# EAGLE design Tractive System Active Light rev1 (EAGLE 9.5.2)
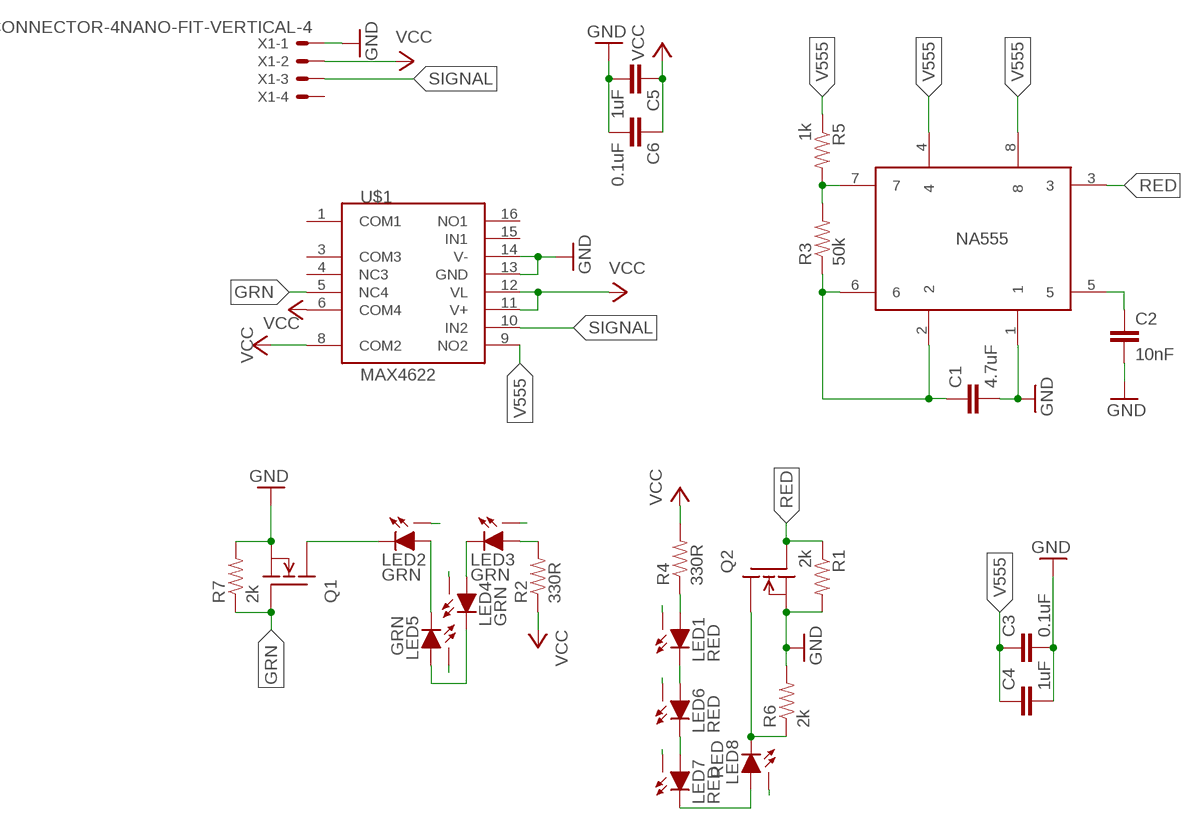
[diagram p0: schematic, sheet 1]

## Parts
C1  4.7uF  CAP0603-CAP  [0603-CAP]
C2  10nF  CAP0603-CAP  [0603-CAP]
C3  0.1uF  CAP0603-CAP  [0603-CAP]
C4  1uF  CAP0603-CAP  [0603-CAP]
C5  1uF  CAP0603-CAP  [0603-CAP]
C6  0.1uF  CAP0603-CAP  [0603-CAP]
LED1  RED  XP-E2XP-E2  [XP-E2]
LED2  GRN  XP-E2XP-E2  [XP-E2]
LED3  GRN  XP-E2XP-E2  [XP-E2]
LED4  GRN  XP-E2XP-E2  [XP-E2]
LED5  GRN  XP-E2XP-E2  [XP-E2]
LED6  RED  XP-E2XP-E2  [XP-E2]
LED7  RED  XP-E2XP-E2  [XP-E2]
LED8  RED  XP-E2XP-E2  [XP-E2]
NA555  NA555SO-8  [SOIC-08]
Q1  DMG3406LSOT  [SOT23]
Q2  DMG3406LSOT  [SOT23]
R1  2k  RESISTOR0603-RES  [0603-RES]
R2  330R  RESISTOR0603-RES  [0603-RES]
R3  50k  RESISTOR0603-RES  [0603-RES]
R4  330R  RESISTOR0603-RES  [0603-RES]
R5  1k  RESISTOR0603-RES  [0603-RES]
R6  2k  RESISTOR0603-RES  [0603-RES]
R7  2k  RESISTOR0603-RES  [0603-RES]
U$1  MAX4622  [SO16]
X1  CONNECTOR-4NANO-FIT-VERTICAL-4  [NANO-FIT_VERTICAL-4]

## Nets
GND: C1.2 C2.2 C3.2 C4.2 C5.2 C6.2 NA555.1 Q1.2(S) Q2.2(S) R1.2 R6.2 R7.2 U$1.13(GND) U$1.14(V-) X1.P$1
GRN: Q1.1(G) R7.1 U$1.5(NC4)
LED1_THERM: LED1.X
LED2_THERM: LED2.X
LED3_THERM: LED3.X
LED4_THERM: LED4.X
LED5_THERM: LED5.X
LED6_THERM: LED6.X
LED7_THERM: LED7.X
LED8_THERM: LED8.X
N$1: LED4.C LED5.A
N$2: LED2.C Q1.3(D)
N$3: LED3.C LED4.A
N$5: LED3.A R2.2
N$8: C1.1 NA555.2 NA555.6 R3.1
N$9: NA555.7 R3.2 R5.2
N$10: LED8.C Q2.3(D) R6.1
N$11: LED1.A R4.1
N$13: C2.1 NA555.5
N$16: LED2.A LED5.C
N$17: LED1.C LED6.A
N$18: LED6.C LED7.A
N$19: LED7.C LED8.A
RED: NA555.3 Q2.1(G) R1.1
SIGNAL: U$1.10(IN2) X1.P$3
V555: C3.1 C4.1 NA555.4 NA555.8 R5.1 U$1.9(NO2)
VCC: C5.1 C6.1 R2.1 R4.2 U$1.6(COM4) U$1.8(COM2) U$1.11(V+) U$1.12(VL) X1.P$2
Unconnected: U$1.1(COM1) U$1.3(COM3) U$1.4(NC3) U$1.15(IN1) U$1.16(NO1) X1.P$4

## Library data of the parts
C1-C6 = HyTechDevices:CAP: Capacitor Standard 0603 ceramic capacitor, and 0.1" leaded capacitor.
LED1-LED8 = HyTechDevices:XP-E2: XP-E2 high-brightness LED. Data sheet <https://www.cree.com/led-components/media/documents/XLampXPE2.pdf>
NA555 = HyTechDevices:NA555: Texas Instruments NA555 timer. Data sheet <http://www.ti.com/lit/ds/symlink/se555.pdf>
Q1 Q2 = HyTechDevices:DMG3406L: Generic NPN MOSFET DMG3406L (SOT-23, 2.8 A 30V)
R1-R7 = HyTechDevices:RESISTOR: Resistor Basic schematic elements and footprints for 0603, 1206, and PTH resistors.
U$1 = HyTechDevices:MAX4622: Maxim Integrated MAX 4622 analogue switch. Data sheet <https://datasheets.maximintegrated.com/en/ds/MAX4621-MAX4623.pdf>
X1 = HyTechDevices:CONNECTOR-4: Mini-Fit Junior connector 4 pole Source: http://www.molex.com

## Board
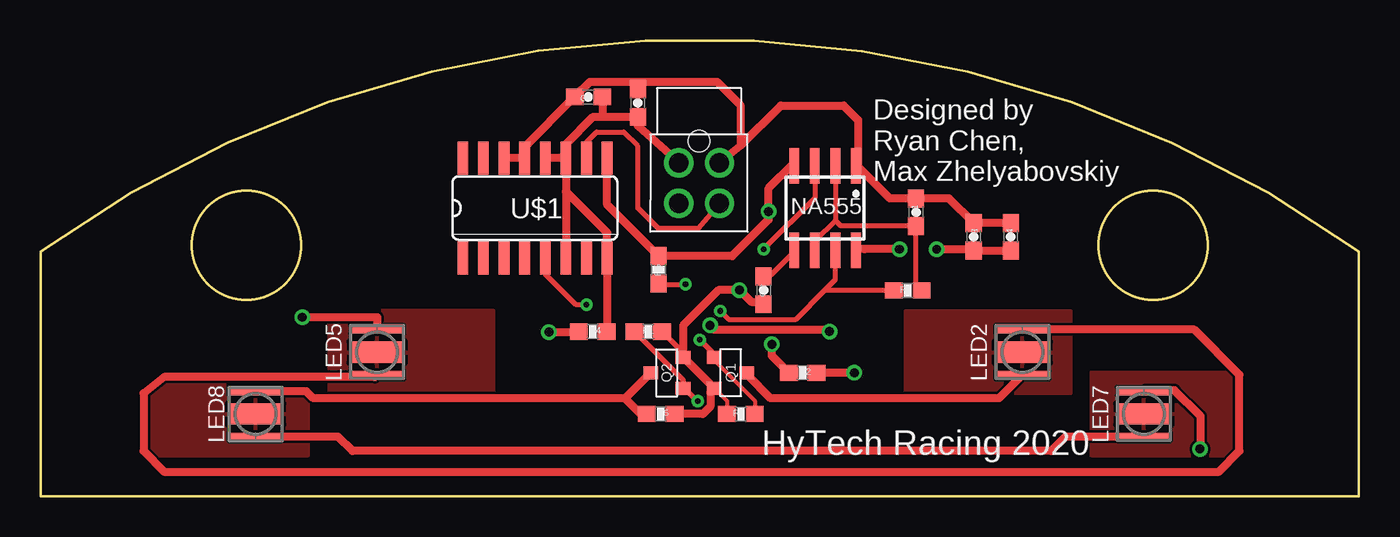
[diagram p1: board, top side]
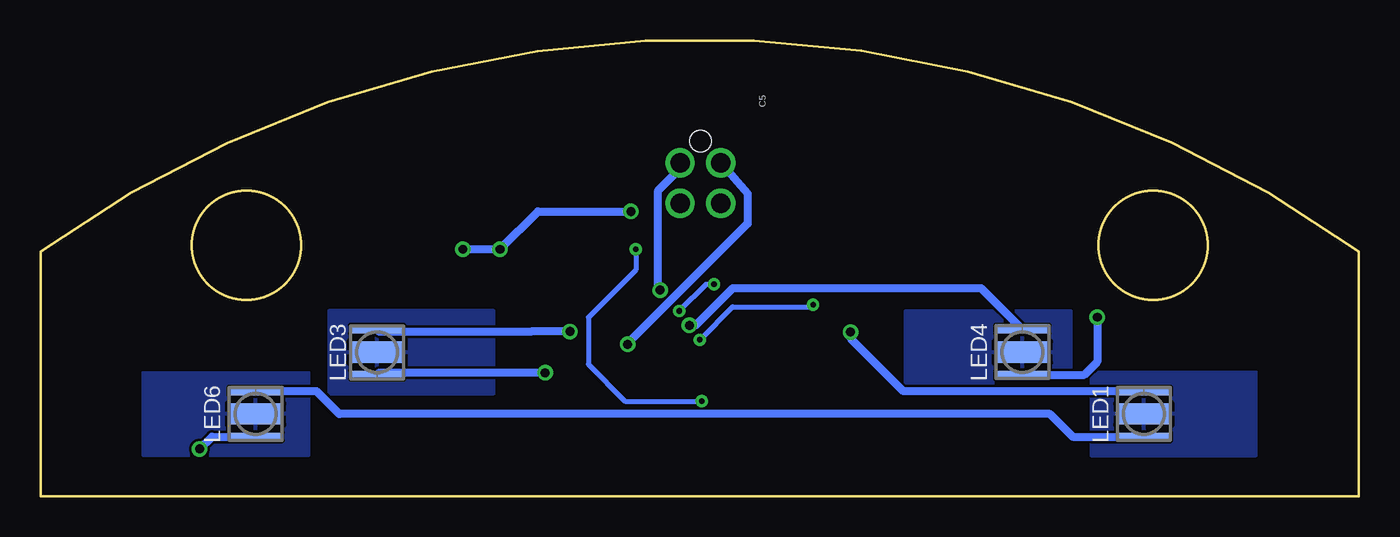
[diagram p2: board, bottom side, seen from below]

Size 81.28 x 28.12 mm. Coordinates in mm from the lower left corner, seen from the top.
Outline: 81.28,0 0,0 0,15.11 arc-71 81.28,15.09 81.28,0
Outline: circle at 68.58,15.49 radius 3.35
Outline: circle at 12.7,15.49 radius 3.35
Copper layers (1*16): Top 0.035mm / dielectric 1.5mm / Bottom 0.035mm
Design rules "DRC Advanced Circuits": minimum track width 6mil, minimum drill 10mil, track to track 6mil, track to pad 6mil, pad to pad 6mil, via to via 6mil, smd to smd 6mil, copper to edge 40mil, drill to drill 6mil, minimum pad ring 10mil, minimum via ring 8mil, stop-mask expansion 4mil, vias tented up to drill 0mil, thermal gap 10mil

### Footprints (pad centres in the part's own frame; a part is rotated, then mirrored left to right if it is on the bottom)
0603-CAP = smd 1.1 x 1: 1 -0.85,0; 2 0.85,0
XP-E2 = smd 0.5 x 3.3: A -1.4,0; C 1.4,0 | smd 1.3 x 3.3: X 0,0
SOIC-08 = smd 0.6 x 2.2: 1 -1.905,-2.6; 2 -0.635,-2.6; 3 0.635,-2.6; 4 1.905,-2.6; 5 1.905,2.6; 6 0.635,2.6; 7 -0.635,2.6; 8 -1.905,2.6
SOT23 = smd 0.8 x 0.9: 1 -0.95,-1; 2 0.95,-1; 3 0,1
0603-RES = smd 1.1 x 1: 1 -0.85,0; 2 0.85,0
SO16 = smd 0.66 x 2.032: 1 -4.445,-3.073; 2 -3.175,-3.073; 3 -1.905,-3.073; 4 -0.635,-3.073; 5 0.635,-3.073; 6 1.905,-3.073; 7 3.175,-3.073; 8 4.445,-3.073; 9 4.445,3.073; 10 3.175,3.073; 11 1.905,3.073; 12 0.635,3.073; 13 -0.635,3.073; 14 -1.905,3.073; 15 -3.175,3.073; 16 -4.445,3.073
NANO-FIT_VERTICAL-4 = drill 1.2: P$1 -1.25,0; P$2 1.25,0; P$3 -1.25,2.5; P$4 1.25,2.5 | hole 1.3: 0,-1.34

### Placement (x,y rotation side)
C1  53.98,17.53 90 top
C2  44.58,12.7 270 top
C3  57.53,16 90 top
C4  59.82,16 90 top
C5  36.83,24.26 90 top
C6  33.78,24.64 180 top
LED1  13.26,5.08 270 bottom
LED2  60.53,8.89 270 top
LED3  60.53,8.89 90 bottom
LED4  20.75,8.89 270 bottom
LED5  20.75,8.89 270 top
LED6  68.02,5.08 270 bottom
LED7  68.02,5.08 270 top
LED8  13.26,5.08 90 top
NA555  48.37,17.78 180 top
Q1  42.55,7.62 270 top
Q2  38.61,7.62 90 top
R1  37.47,10.16 0 top
R2  46.99,7.62 0 top
R3  53.47,12.7 180 top
R4  34.04,10.16 0 top
R5  38.1,13.97 270 top
R6  38.23,5.08 0 top
R7  43.18,5.08 180 top
U$1  30.48,17.78 0 top
X1  40.6,20.57 180 top

### Tracks (layer width: path | path; a pad name or v marks a point on that pad's centre or on a via)
GND  (via drill 0.55)
  Top 0.152: 53.87,18.39 C1.2 | 50.37,20.37 NA555.1 | 44.58,11.99 C2.2
  Top 0.254: Q1.2 42.33,5.89 R7.2
  Top 0.305: R1.2 39.61,8.87 39.61,8.61
  Top 0.508: 53.87,18.39 52.35,18.39 50.37,20.37 | NA555.1 50.4,20.51 50.4,23.21 49.51,24.11 45.63,24.11 43.15,21.62 | 44.58,11.99 43.81,11.99 v43.08,12.73 41.81,12.73 39.61,10.52 39.61,8.61 39.65,8.57 | 43.15,21.62 43.15,24.13 41.73,25.55 36.83,25.55 | C1.2 56.01,18.38 C3.2 C4.2 | U$1.14 U$1.13 29.84,21.55 C6.2 33.85,25.55 36.83,25.55 | C5.2 36.83,25.55 | 39.65,8.57 Q1.2 41.3,6.42 41.3,5.54 40.84,5.08 R6.2 | 39.65,8.57 Q2.2 | X1.P$1 43.15,21.62
  Bottom 0.152: 41.86,20.22 X1.P$1
  Bottom 0.508: v43.08,12.73 43.2,12.85 43.2,18.87 41.86,20.22
GRN  (via drill 0.35)
  Top 0.254: Q1.1 41.55,8.38 44.03,5.89 R7.1
  Top 0.305: v33.66,11.81 33.02,11.81 31.12,13.72 U$1.5 | v40.64,9.65 41.55,8.75 Q1.1
  Bottom 0.305: v33.66,11.81 33.78,11.68 38.61,11.68 v40.64,9.65
LED1_THERM
  pour Bottom: 6.35,2.54 6.35,7.62 16.51,7.62 16.51,2.54
LED2_THERM
  pour Top: 53.34,6.35 53.34,11.43 63.5,11.43 63.5,6.35
LED3_THERM
  pour Bottom: 63.5,11.43 63.5,6.35 53.34,6.35 53.34,11.43
LED4_THERM
  pour Bottom: 27.94,11.43 17.78,11.43 17.78,6.35 27.94,6.35
LED5_THERM
  pour Top: 17.78,11.43 17.78,6.35 27.94,6.35 27.94,11.43
LED6_THERM
  pour Bottom: 74.93,7.62 64.77,7.62 64.77,2.54 74.93,2.54
LED7_THERM
  pour Top: 74.93,2.54 74.93,7.62 64.77,7.62 64.77,2.54
LED8_THERM
  pour Top: 6.35,7.62 6.35,2.54 16.51,2.54 16.51,7.62
N$1  (via drill 0.55)
  Top 0.508: v16.13,11.05 20.75,11.05 LED5.A
  Bottom 0.508: v16.13,11.05 16.13,8.3 16.94,7.49 LED4.C
N$2
  Top 0.508: Q1.3 43.55,7.51 45.01,6.05 59.08,6.05 LED2.C
N$3  (via drill 0.55)
  Top 0.508: v41.27,10.54 41.53,10.29 48.51,10.29 v48.64,10.16
  Bottom 0.508: LED3.C 60.4,10.16 51.05,10.16 v48.64,10.16 | v41.27,10.54 40.89,10.54 38.61,12.83 23.29,12.83 LED4.A
N$5  (via drill 0.55)
  Top 0.508: v50.16,7.62 R2.2
  Bottom 0.508: v50.16,7.62 60.4,7.62 LED3.A
N$8
  Top 0.152: 47.78,15.8 47.78,15.19 NA555.6
  Top 0.305: 47.78,15.8 49,17.02 | R3.1 53.98,13.04 C1.1 49.34,16.68 49,17.02 | NA555.2 49,17.02
N$9  (via drill 0.35)
  Top 0.305: R5.2 38.14,13.08 v39.76,13.08 | v41.91,11.43 42.42,10.92 46.56,10.92 48.36,12.73 | NA555.7 49,13.36 48.36,12.73 | R3.2 48.39,12.7 48.36,12.73
  Bottom 0.305: v39.76,13.08 40.26,13.08 v41.91,11.43
N$10
  Top 0.508: LED8.C 16.38,6.48 16.82,6.05 36.03,6.05 | Q2.3 36.03,6.05 | 36.03,6.05 37,5.08 R6.1
N$11  (via drill 0.55)
  Top 0.508: v31.34,10.14 33.16,10.14 R4.1
  Bottom 0.508: LED1.A 28.07,6.48 31.34,9.75 v31.34,10.14
N$13
  Top 0.152: 45.03,13.66 44.58,13.66 C2.1 | 46.41,15.04 NA555.5
  Top 0.305: 46.41,15.04 45.03,13.66
N$16
  Top 0.508: LED2.A 71.12,10.29 73.91,7.49 73.91,2.79 72.64,1.52 7.62,1.52 6.35,2.79 6.35,6.35 7.62,7.36 20.62,7.36 LED5.C
N$17
  Bottom 0.508: LED1.C 17.65,3.68 19.05,5.08 62.87,5.08 64.27,6.48 LED6.A
N$18  (via drill 0.55)
  Top 0.152: 68.08,6.54 LED7.A
  Top 0.508: v71.47,2.92 71.5,2.95 71.5,4.95 69.91,6.54 68.08,6.54
  Bottom 0.508: v71.47,2.92 70.71,3.68 LED6.C
N$19
  Top 0.508: LED7.C 63.2,3.68 62.31,2.79 19.23,2.79 18.34,3.68 LED8.A
RED  (via drill 0.35)
  Top 0.305: NA555.3 47.73,18.39 v44.58,15.24 | v40.51,5.86 39.71,6.67 Q2.1 39.61,7.17 R1.1
  Bottom 0.305: v44.58,15.24 44.58,13.97 47.51,11.04 47.51,8.14 45.23,5.86 v40.51,5.86
SIGNAL
  Top 0.152: U$1.10 33.66,21.84
  Top 0.305: 33.66,21.84 34.29,22.48 35.94,22.48 36.83,21.59 36.83,17.78 38.1,16.51 40.54,16.51 X1.P$3
V555  (via drill 0.55)
  Top 0.152: 46.41,20.52 NA555.4 | 57.44,15.24 C3.1
  Top 0.508: U$1.9 34.92,18 R5.1 42.63,14.82 44.88,17.07 v44.88,17.58 44.88,19 46.41,20.52 | v55.25,15.24 57.44,15.24 | C3.1 C4.1 | v52.96,15.24 50.8,15.24 50.42,15.24 50.33,15.24 NA555.8
  Bottom 0.508: v55.25,15.24 v52.96,15.24 50.62,17.58 v44.88,17.58
VCC  (via drill 0.55)
  Top 0.508: R4.2 34.92,10.2 U$1.8 34.92,16.26 32.38,18.8 | U$1.11 U$1.12 | 34.67,23.41 34.08,23.41 32.38,21.72 U$1.11 | 34.67,23.41 C5.1 36.83,22.84 X1.P$2 | C6.1 34.63,23.45 34.67,23.41 | U$1.11 32.38,18.8 | 32.38,18.8 U$1.6 | R2.1 45.09,8.68 v45.09,9.38
  Bottom 0.508: X1.P$2 37.69,18.66 37.69,16.82 45.09,9.42 v45.09,9.38

### Text on the board
tNames: Designed by / Ryan Chen, / Max Zhelyabovskiy | HyTech Racing 2020
tDocu: Tractive System Active Light rev1
bDocu: HyTech Racing 2020 | Tractive System Active Light rev1